# Altium project Adafruit RA8875 TFT Breakout.PrjPcb
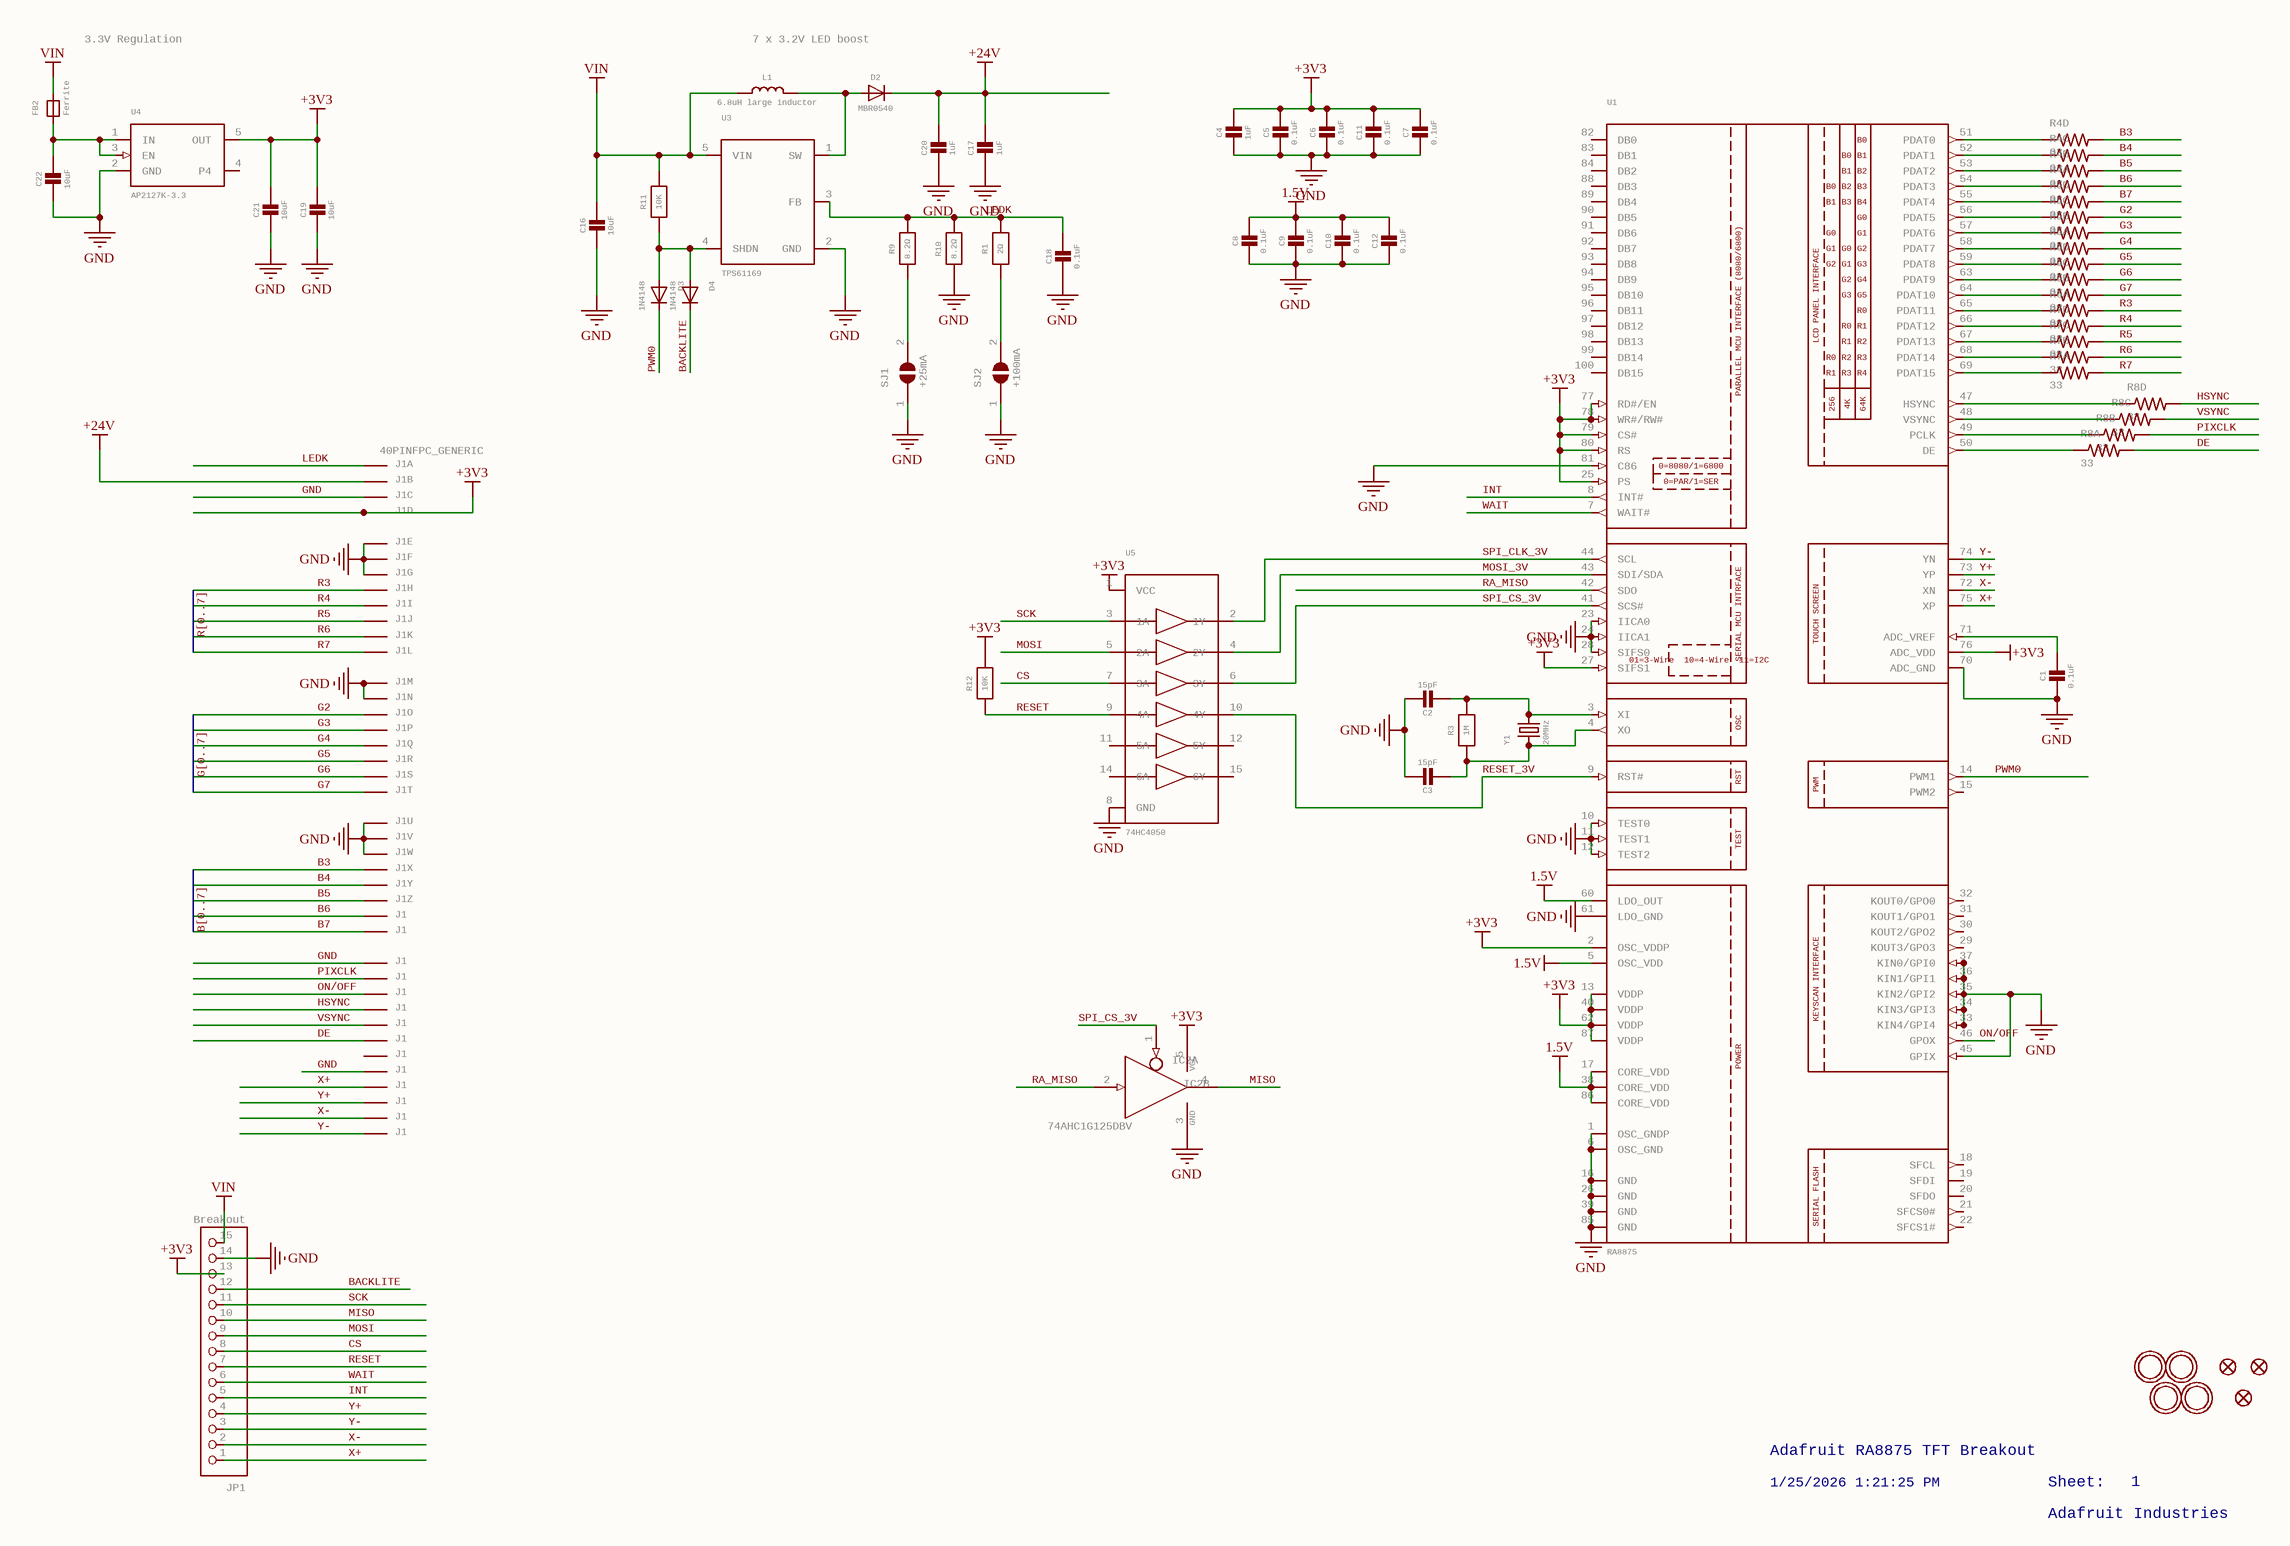
[diagram p0: Adafruit RA8875 TFT Breakout.SchDoc]
1 sheet, 52 parts. Net scope: global (net labels, ports and power ports of the same name join across sheets).

## Sheet Adafruit RA8875 TFT Breakout.SchDoc: Adafruit RA8875 TFT Breakout
size 409 x 289 mm; Origin: Eagle; Date: 1/25/2026 1:21:25 PM; SheetNumber: 1; GateName_1: G$1; SymbolName_1: FRAME_A3_ADAFRUIT; LibraryName: microbuilder; DeviceSetName: FRAME_A3_ADAFRUIT; Sheet: Sheet:; AdafruitIndustries: Adafruit Industries

### Parts
C1  0.1uF  [0603-NO]
C2  15pF  [0603-NO]
C3  15pF  [0603-NO]
C4  1uF  [0805-NO]
C5  0.1uF  [0603-NO]
C6  0.1uF  [0603-NO]
C7  0.1uF  [0603-NO]
C8  0.1uF  [0603-NO]
C9  0.1uF  [0603-NO]
C10  0.1uF  [0603-NO]
C11  0.1uF  [0603-NO]
C12  0.1uF  [0603-NO]
C16  10uF  [0805-NO]
C17  1uF  [0805-NO]
C18  0.1uF  [0603-NO]
C19  10uF  [0805-NO]
C20  1uF  [0805-NO]
C21  10uF  [0805-NO]
C22  10uF  [0805-NO]
D2  MBR0540  [SOD-123]
D3  1N4148  [SOD-323_MINI]
D4  1N4148  [SOD-323_MINI]
FB2  Ferrite  [0805-NO]
FID1  FIDUCIAL_1MM  [FIDUCIAL_1MM]  (value not drawn)
FID2  FIDUCIAL_1MM  [FIDUCIAL_1MM]  (value not drawn)
FID3  FIDUCIAL_1MM  [FIDUCIAL_1MM]  (value not drawn)
IC2  74AHC1G125DBV  [SOT23-5]  (parts A,B of 2)
J1  40PINFPC_GENERIC  [FPC_40]  (parts A,B,C,D,E,F,G,H,I,J,K,L,M,N,O,P,Q,R,S,T,U,V,W,X,Y,Z,27,28,29,30,31,32,33,34,35,36,37,38,39,40 of 40)
JP1  Breakout  [1X15-CB]
L1  6.8uH large inductor  [INDUCTOR_5X5MM_NR5040_NOTHERMALS]
R1  2Ω  [0805-NO]
R3  1M  [0603-NO]
R4  33  [RESPACK_4X0603]  (parts A,B,C,D of 4)
R5  33  [RESPACK_4X0603]  (parts A,B,C,D of 4)
R6  33  [RESPACK_4X0603]  (parts A,B,C,D of 4)
R7  33  [RESPACK_4X0603]  (parts A,B,C,D of 4)
R8  33  [RESPACK_4X0603]  (parts A,B,C,D of 4)
R9  8.2Ω  [0805-NO]
R10  8.2Ω  [0805-NO]
R11  10K  [0603-NO]
R12  10K  [0603-NO]
SJ1  +25mA  [SOLDERJUMPER_ARROW_NOPASTE]
SJ2  +100mA  [SOLDERJUMPER_ARROW_NOPASTE]
U1  RA8875  LCDPANELINTERFACE: LCD PANEL INTERFACE  TOUCHSCREEN: TOUCH SCREEN  KEYSCANINTERFACE: KEYSCAN INTERFACE  SERIALFLASH: SERIAL FLASH  SERIALMCUINTRFACE: SERIAL MCU INTRFACE  PARALLELMCUINTERFACE(8080/6800): PARALLEL MCU INTERFACE (8080/6800)  01=3-Wire
10=4-Wire
11=I2C: 01=3-Wire / 10=4-Wire / 11=I2C  [LQFP100]
U3  TPS61169  [SC70-5]
U4  AP2127K-3.3  [SOT23-5]
U5  74HC4050  [TSSOP16]
U$21  MOUNTINGHOLE2.5  [MOUNTINGHOLE_2.5_PLATED]  (value not drawn)
U$22  MOUNTINGHOLE2.5  [MOUNTINGHOLE_2.5_PLATED]  (value not drawn)
U$23  MOUNTINGHOLE2.5  [MOUNTINGHOLE_2.5_PLATED]  (value not drawn)
U$24  MOUNTINGHOLE2.5  [MOUNTINGHOLE_2.5_PLATED]  (value not drawn)
Y1  20MHz  [CRYSTAL_3.2X2.5]

### Nets
1.5V: C8.1 C9.1 C10.1 C12.1 U1.5(OSC_VDD) U1.17(CORE_VDD) U1.38(CORE_VDD) U1.60(LDO_OUT) U1.86(CORE_VDD)
+3V3: C4.1 C5.1 C6.1 C7.1 C11.1 C19.1 C21.1 IC2.5(VCC) J1.4(MS) JP1.13 R12.2 U1.2(OSC_VDDP) U1.13(VDDP) U1.25(PS) U1.27(SIFS1) U1.40(VDDP) U1.62(VDDP) U1.76(ADC_VDD) U1.77(RD#/EN) U1.78(WR#/RW#) U1.79(CS#) U1.80(RS) U1.87(VDDP) U4.5(OUT) U5.1(VCC)
+24V: C17.1 C20.1 D2.C J1.2(MS)
GND: C1.2 C2.1 C3.1 C4.2 C5.2 C6.2 C7.2 C8.2 C9.2 C10.2 C11.2 C12.2 C16.2 C17.2 C18.2 C19.2 C20.2 C21.2 C22.2 IC2.3(GND) J1.3(MS) J1.5(MS) J1.6(MS) J1.7(MS) J1.13(MS) J1.14(MS) J1.21(MS) J1.22(MS) J1.23(MS) J1.29(MS) J1.36(MS) JP1.14 R10.1 SJ1.1 SJ2.1 U1.1(OSC_GNDP) U1.6(OSC_GND) U1.10(TEST0) U1.11(TEST1) U1.12(TEST2) U1.16(GND) U1.23(IICA0) U1.24(IICA1) U1.26(GND) U1.28(SIFS0) U1.33(KIN4/GPI4) U1.34(KIN3/GPI3) U1.35(KIN2/GPI2) U1.36(KIN1/GPI1) U1.37(KIN0/GPI0) U1.39(GND) U1.45(GPIX) U1.61(LDO_GND) U1.70(ADC_GND) U1.81(C86) U1.85(GND) U3.2(GND) U4.2(GND) U5.8(GND)
VIN: C16.1 FB2.2(P$2) JP1.15 L1.P$1 R11.2 U3.5(VIN)
B3: J1.24(MS) R4.5
B4: J1.25(MS) R4.6  [also labelled B[0..7]]
B5: J1.26(MS) R4.7
B6: J1.27(MS) R4.8
B7: J1.28(MS) R5.5
BACKLITE: D4.C JP1.12
CS: JP1.8 U5.7(3A)
DE: J1.34(MS) R8.8
G2: J1.15(MS) R5.6
G3: J1.16(MS) R5.7  [also labelled G[0..7]]
G4: J1.17(MS) R5.8
G5: J1.18(MS) R6.5
G6: J1.19(MS) R6.6
G7: J1.20(MS) R6.7
HSYNC: J1.32(MS) R8.5
INT: JP1.5 U1.8(INT#)
LEDK: C18.1 J1.1(MSV) R1.2 R9.2 R10.2 U3.3(FB)
MISO: IC2.4(O) JP1.10
MOSI: JP1.9 U5.5(2A)
MOSI_3V: U1.43(SDI/SDA) U5.4(2Y)
ON/OFF: J1.31(MS) U1.46(GPOX)
PIXCLK: J1.30(MS) R8.7
PWM0: D3.C U1.14(PWM1)
R3: J1.8(MS) R6.8  [also labelled R[0..7]]
R4: J1.9(MS) R7.5
R5: J1.10(MS) R7.6
R6: J1.11(MS) R7.7
R7: J1.12(MS) R7.8
RA_MISO: IC2.2(I) U1.42(SDO)
RESET: JP1.7 R12.1 U5.9(4A)
RESET_3V: U1.9(RST#) U5.10(4Y)
SCK: JP1.11 U5.3(1A)
SPI_CLK_3V: U1.44(SCL) U5.2(1Y)
SPI_CS_3V: IC2.1(OE) U1.41(SCS#) U5.6(3Y)
VSYNC: J1.33(MS) R8.6
WAIT: JP1.6 U1.7(WAIT#)
X+: J1.37(MS) JP1.1 U1.75(XP)
X-: J1.39(MS) JP1.2 U1.72(XN)
Y+: J1.38(MS) JP1.4 U1.73(YP)
Y-: J1.40(MS) JP1.3 U1.74(YN)
NetC1_1: C1.1 U1.71(ADC_VREF)
NetC2_2: C2.2 R3.2 U1.3(XI) Y1.2
NetC3_2: C3.2 R3.1 U1.4(XO) Y1.1
NetC22_1: C22.1 FB2.1(P$1) U4.1(IN) U4.3(EN)
NetD2_A: D2.A L1.P$2 U3.1(SW)
NetD3_A: D3.A D4.A R11.1 U3.4(SHDN)
NetR1_1: R1.1 SJ2.2
NetR4_1: R4.1 U1.54(PDAT3)
NetR4_2: R4.2 U1.53(PDAT2)
NetR4_3: R4.3 U1.52(PDAT1)
NetR4_4: R4.4 U1.51(PDAT0)
NetR5_1: R5.1 U1.58(PDAT7)
NetR5_2: R5.2 U1.57(PDAT6)
NetR5_3: R5.3 U1.56(PDAT5)
NetR5_4: R5.4 U1.55(PDAT4)
NetR6_1: R6.1 U1.65(PDAT11)
NetR6_2: R6.2 U1.64(PDAT10)
NetR6_3: R6.3 U1.63(PDAT9)
NetR6_4: R6.4 U1.59(PDAT8)
NetR7_1: R7.1 U1.69(PDAT15)
NetR7_2: R7.2 U1.68(PDAT14)
NetR7_3: R7.3 U1.67(PDAT13)
NetR7_4: R7.4 U1.66(PDAT12)
NetR8_1: R8.1 U1.50(DE)
NetR8_2: R8.2 U1.49(PCLK)
NetR8_3: R8.3 U1.48(VSYNC)
NetR8_4: R8.4 U1.47(HSYNC)
NetR9_1: R9.1 SJ1.2

Not connected (* = marked no-connect by the designer): J1 35(MS); U1 15(PWM2) 18(SFCL) 19(SFDI) 20(SFDO) 21(SFCS0#) 22(SFCS1#) 29(KOUT3/GPO3) 30(KOUT2/GPO2) 31(KOUT1/GPO1) 32(KOUT0/GPO0) 82(DB0) 83(DB1) 84(DB2) 88(DB3) 89(DB4) 90(DB5) 91(DB6) 92(DB7) 93(DB8) 94(DB9) 95(DB10) 96(DB11) 97(DB12) 98(DB13) 99(DB14) 100(DB15); U4 4(P4); U5 11(5A) 12(5Y) 14(6A) 15(6Y)

### Notes on the sheet
- 3.3V Regulation
- 7 x 3.2V LED boost
- Adafruit RA8875 TFT Breakout
- 1/25/2026 1:21:25 PM
- Sheet:
- Adafruit Industries
- 1

### Library data of the parts
C1-C3 C5-C12 C18 = CAP_CERAMIC0603_NO: Ceramic Capacitors   For new designs, use the packages preceded by an '_' character since they are more reliable:   The following footprints should be used on most boards: _0402 - Standard footprint for regular board layouts  _0603 - Standard footprint for regular board layouts  _0805 - Standard footprint for regular board layouts  _1206 - Standard footprint for regular board layouts       For extremely tight-pitch boards where space is at a premium, the following 'micro-pitch' footprints can be used (smaller pads, no silkscreen outline, etc.): _0402MP - Micro-pitch footprint for very dense/compact boards  _0603MP - Micro-pitch footprint for very dense/compact boards  _0805MP - Micro-pitch footprint for very dense/compact boards  _1206MP - Micro-pitch footprint for very dense/compact boards; GateName_1: G$1; SymbolName_1: CAPACITOR; DeviceName: 0603_NO; LibraryName: microbuilder; DeviceSetName: CAP_CERAMIC
C4 C16 C17 C19-C22 = CAP_CERAMIC0805-NOOUTLINE: Ceramic Capacitors   For new designs, use the packages preceded by an '_' character since they are more reliable:   The following footprints should be used on most boards: _0402 - Standard footprint for regular board layouts  _0603 - Standard footprint for regular board layouts  _0805 - Standard footprint for regular board layouts  _1206 - Standard footprint for regular board layouts       For extremely tight-pitch boards where space is at a premium, the following 'micro-pitch' footprints can be used (smaller pads, no silkscreen outline, etc.): _0402MP - Micro-pitch footprint for very dense/compact boards  _0603MP - Micro-pitch footprint for very dense/compact boards  _0805MP - Micro-pitch footprint for very dense/compact boards  _1206MP - Micro-pitch footprint for very dense/compact boards; GateName_1: G$1; SymbolName_1: CAPACITOR; DeviceName: 0805-NOOUTLINE; LibraryName: microbuilder; DeviceSetName: CAP_CERAMIC
D2 = DIODESOD-123: Diode    SMA      Model	  Volts	  Amps	  Type	  Vf	  Ir	  Digikey #	  Notes	     SSA34-E3	  40V	  3A	  Schottky	  480mV @ 3A	  200uA @ 40V	  SSA34-E3/61TGITR-ND	  	     CDBA120-G	  20V	  1A	  Schottky	  500mV @ 1A	  500uA @ 20V	  641-1014-6-ND	  REEL	     MBRA210	  10V	  2A	  Schottky	  350mV @ 2A	  700uA @ 10V	  MBRA210LT3	  	 SOD-123      Model	  Volts	  Amps	  Type	  Vf	  Ir	  Order #	  Notes	     BAT54T1G	  30V	  200mA	  Schottky	  800mV @ 200mA	  2uA @ 25V	  BAT54T1GOSTR-ND	  	     B0530W	  30V	  500mA	  Schottky	  430mV @ 500mA	  130uA @ 30V	  B0530W-FDICT-ND	  REEL	     MBR120	  20V	  1A	  Schottky	  340mV @ 1A	  	  MBR120VLSFT1GOSCT-ND	  	 SOD-323      Model	  Volts	  Amps	  Type	  Vf	  Ir	  Order #	  Notes	     PMEG2005EJ	  20V	  500mA	  Schottky	  355mV @ 500mA	  	  568-4110-1-ND	  	     ZLLS410	  10V	  570mA	  Schottky	  380mV @ 570mA	  	  ZLLS410CT-ND	  	     1N4148WS	  75V	  150mA	  Silicon/Simple	  1V	  	  1N4148WSFSCT-ND	  REEL	 SOD-523      Model	  Volts	  Amps	  Type	  Vf	  Ir	  Order #	  Notes	     BAT54XV2	  30V	  200mA	  Schottky	  0.8V @ 100mA	  	  BAT54XV2CT-ND	  	     TB751S	  30V	  30mA	  Schottky	  	  	  RB751S-40TE61CT-ND	  	 SOT23-R/W (R = Solder Paste/Reflow Ovens, W = Hand-Soldering)       Model	  Volts	  Amps	  Type	  Vf	  Ir	  Order #	  Notes	     BAT54FILM	  40V	  300mA	  Schottky	  	  	  497-7162-1-ND	  	 POWERDI-5       Model	  Volts	  Amps	  Type	  Vf	  Ir	  Order #	  Notes	     PDS560	  60V	  5A	  Schottky	  670mV @ 5A	  150uA @ 60V	  PDS560DICT-ND; GateName_1: G$1; SymbolName_1: DIODE; DeviceName: SOD-123; LibraryName: microbuilder; DeviceSetName: DIODE
D3 D4 = DIODE_SOD323MINI: Diode    SMA      Model	  Volts	  Amps	  Type	  Vf	  Ir	  Digikey #	  Notes	     SSA34-E3	  40V	  3A	  Schottky	  480mV @ 3A	  200uA @ 40V	  SSA34-E3/61TGITR-ND	  	     CDBA120-G	  20V	  1A	  Schottky	  500mV @ 1A	  500uA @ 20V	  641-1014-6-ND	  REEL	     MBRA210	  10V	  2A	  Schottky	  350mV @ 2A	  700uA @ 10V	  MBRA210LT3	  	 SOD-123      Model	  Volts	  Amps	  Type	  Vf	  Ir	  Order #	  Notes	     BAT54T1G	  30V	  200mA	  Schottky	  800mV @ 200mA	  2uA @ 25V	  BAT54T1GOSTR-ND	  	     B0530W	  30V	  500mA	  Schottky	  430mV @ 500mA	  130uA @ 30V	  B0530W-FDICT-ND	  REEL	     MBR120	  20V	  1A	  Schottky	  340mV @ 1A	  	  MBR120VLSFT1GOSCT-ND	  	 SOD-323      Model	  Volts	  Amps	  Type	  Vf	  Ir	  Order #	  Notes	     PMEG2005EJ	  20V	  500mA	  Schottky	  355mV @ 500mA	  	  568-4110-1-ND	  	     ZLLS410	  10V	  570mA	  Schottky	  380mV @ 570mA	  	  ZLLS410CT-ND	  	     1N4148WS	  75V	  150mA	  Silicon/Simple	  1V	  	  1N4148WSFSCT-ND	  REEL	 SOD-523      Model	  Volts	  Amps	  Type	  Vf	  Ir	  Order #	  Notes	     BAT54XV2	  30V	  200mA	  Schottky	  0.8V @ 100mA	  	  BAT54XV2CT-ND	  	     TB751S	  30V	  30mA	  Schottky	  	  	  RB751S-40TE61CT-ND	  	 SOT23-R/W (R = Solder Paste/Reflow Ovens, W = Hand-Soldering)       Model	  Volts	  Amps	  Type	  Vf	  Ir	  Order #	  Notes	     BAT54FILM	  40V	  300mA	  Schottky	  	  	  497-7162-1-ND	  	 POWERDI-5       Model	  Volts	  Amps	  Type	  Vf	  Ir	  Order #	  Notes	     PDS560	  60V	  5A	  Schottky	  670mV @ 5A	  150uA @ 60V	  PDS560DICT-ND; GateName_1: G$1; SymbolName_1: DIODE; DeviceName: _SOD323MINI; LibraryName: microbuilder; DeviceSetName: DIODE
FB2 = FERRITE-0805NO: Ferrite Bead   0603 MMZ1608B121C - 120 Ohm @ 100MHz, 600mA, 0.15 Ohm DC Resistance - Digikey: 445-2164-1-ND  BK1608HW121-T - 120 Ohm, 600mA Ferrite Chip - Digikey: 587-1876-2-ND       0805 HZ0805B272R-10 - 2.7K Ohm @ 100MHz, 200mA, 0.8 Ohm DC Resistance - Digikey: 240-2504-1-ND (see also Murata BLM21BD272SN1L)  MMZ2012Y152B - 1.5K Ohm @ 100MHz, 500mA, 0.4 Ohm DC Resistance - Digikey: 445-1560-1-ND - Mainly for high frequency (80-400MHz)  MMZ2012R102A - 1K Ohm @ 100MHz, 500mA, 0.3 Ohm DC Resistance - Digikey: 445-1555-2-ND - More general purpose (10-200MHz); GateName_1: G$1; SymbolName_1: FERRITE; DeviceName: -0805NO; LibraryName: microbuilder; DeviceSetName: FERRITE
FID1-FID3 = FIDUCIAL_1MM: Fiducial Alignment Points   Various fiducial points for machine vision alignment.; GateName_1: G$1; DeviceName: _1MM; BOM: EXCLUDE; SymbolName_1: FIDUCIAL; LibraryName: microbuilder; DeviceSetName: FIDUCIAL
IC2 = 74*1G125DBV: Single Bus Buffer Gate with 3-State Output; GateName_1: A; SymbolName_1: 74125; GateName_2: P; SymbolName_2: PWRN; DeviceName: DBV; POPULARITY: 0; LibraryName: 74xx-little-us; DeviceSetName: 74*1G125
J1 = 40PINFPC_GENERIC: OMRON FPC Connector   Source : http://www.omron.com/ecb/products/pdf/fpc.pdf    XF2M-4015-rev is good for connecting up 'PSP' SHARP LQ043 LCDs; GateName_1: -1; SymbolName_1: PV; GateName_2: -2; SymbolName_2: P; GateName_3: -3; GateName_4: -4; GateName_5: -5; GateName_6: -6; GateName_7: -7; GateName_8: -8; GateName_9: -9; GateName_10: -10; GateName_11: -11; GateName_12: -12; GateName_13: -13; GateName_14: -14; GateName_15: -15; GateName_16: -16; GateName_17: -17; GateName_18: -18; GateName_19: -19; GateName_20: -20; GateName_21: -21; GateName_22: -22; GateName_23: -23; GateName_24: -24; GateName_25: -25; GateName_26: -26; GateName_27: -27; GateName_28: -28; GateName_29: -29; GateName_30: -30; GateName_31: -31; GateName_32: -32; GateName_33: -33; GateName_34: -34; GateName_35: -35; GateName_36: -36; GateName_37: -37; GateName_38: -38; GateName_39: -39; GateName_40: -40; SymbolName_3: P; SymbolName_4: P; SymbolName_5: P; SymbolName_6: P; SymbolName_7: P; SymbolName_8: P; SymbolName_9: P; SymbolName_10: P; SymbolName_11: P; SymbolName_12: P; SymbolName_13: P; SymbolName_14: P; SymbolName_15: P; SymbolName_16: P; SymbolName_17: P; SymbolName_18: P; SymbolName_19: P; SymbolName_20: P; SymbolName_21: P; SymbolName_22: P; SymbolName_23: P; SymbolName_24: P; SymbolName_25: P; SymbolName_26: P; SymbolName_27: P; SymbolName_28: P; SymbolName_29: P; SymbolName_30: P; SymbolName_31: P; SymbolName_32: P; SymbolName_33: P; SymbolName_34: P; SymbolName_35: P; SymbolName_36: P; SymbolName_37: P; SymbolName_38: P; SymbolName_39: P; SymbolName_40: P; DeviceName: _GENERIC; LibraryName: adafruit_display; DeviceSetName: 40PINFPC
JP1 = PINHD-1X15-CB: PIN HEADER; GateName_1: A; SymbolName_1: PINHD15; DeviceName: -CB; LibraryName: adafruit; DeviceSetName: PINHD-1X15
L1 = INDUCTORNR5040: Inductors   0603: 10nH Ceramic Inductor - microwire antenna/RF (Digikey: 712-1434-2-ND)       0805: 560nH Ceramic Inductor - RF (Digikey: 553-1047-1-ND)  270nH Ceramic Inductor - Q = 40@250MHz, +-5%, 1 Ohm DC Resistance (Digikey: 535-10506-2-ND)       1007 (2518 Metric) SMT: 10ÂµH 10% 250mOhm 820mA 1007 Inductor (Digikey: 587-2189-1-ND)  22ÂµH 10% 500mOhm 580mA 1007 Inductor (Digikey: 587-2190-1-ND)  47ÂµH 10% 950mOhm 420mA 1007 Inductor (Digikey: 587-2191-1-ND)  47ÂµH 5% 100mOhm 1A 1008 Inductor (Digikey: 732-1816-1-ND)       5.0x5.0mm (Taiyo Yuden NR5040 Series) 6.8ÂµH 20% 2.3A 64mOhm Inductor (Digikey: 587-2374-2-ND)       5.0x5.0mm (TDK VLC5045 Series) 4.7ÂµH 20% 3.3A 34mOhm Inductor (Digikey: 445-6526-1-ND)  6.8ÂµH 20% 2.7A 46mOhm Inductor (Digikey: 445-6527-1-ND)       6.0x6.0mm (TDK VLC6045 Series) 4.7ÂµH 20% 3.8A 27mOhm Inductor (Digikey: 445-6538-2-ND)  6.8ÂµH 20% 3A 41mOhm Inductor (Digikey: 445-6540-1-ND)  6.2ÂµH 30% 2.2A 45mOhm Inductor (Digikey: SRR5028-6R2YCT-ND) - Not TDK VLC6045 but footprint should match       6.0x6.0mm (TDK SLF6045 Series) 6.8uH 30% 2A 33mOhm Inductor (Digikey: 445-4572-1-ND, Mouser: 810-SLF645T6R8N2R0PF)       6.0x6.0mm (Sumida CDRH5D28 Series) 6.2uH 30% 1.8A 45mOhm Inductor (Digikey: 308-1542-1-ND)       Taiyo Yuden NR3015T2R2M - 2.2uH 20% 1.5A (Digikey: 587-1648-2-ND, Mouser: 963-NR3015T2R2M) - Used with TI TPS62172   CoilCraft RFID Transponder Coil - MA5532-AE (For use with AS3935 Lightning Sensor)   Taiyo Yuden NRH2412T2R2MNGH - 2.2uH 20% 1AA (Digikey: 587-3443-1-ND) - Used with TI LM3671   Vishay IHLP  1.0uH Molded Inductor - 24mOhm DCR, 5A, +/-20%, -55Â°C-125Â°C (Digikey: 541-1319-1-ND); GateName_1: G$1; SymbolName_1: INDUCTOR; DeviceName: NR5040; LibraryName: microbuilder; DeviceSetName: INDUCTOR
R1 R9 R10 = RESISTOR0805_NOOUTLINE: Resistors   For new designs, use the packages preceded by an '_' character since they are more reliable:   The following footprints should be used on most boards: _0402 - Standard footprint for regular board layouts  _0603 - Standard footprint for regular board layouts  _0805 - Standard footprint for regular board layouts  _1206 - Standard footprint for regular board layouts       For extremely tight-pitch boards where space is at a premium, the following 'micro-pitch' footprints can be used (smaller pads, no silkscreen outline, etc.): _0402MP - Micro-pitch footprint for very dense/compact boards  _0603MP - Micro-pitch footprint for very dense/compact boards  _0805MP - Micro-pitch footprint for very dense/compact boards  _1206MP - Micro-pitch footprint for very dense/compact boards; GateName_1: G$1; SymbolName_1: RESISTOR; DeviceName: 0805_NOOUTLINE; LibraryName: microbuilder; DeviceSetName: RESISTOR
R3 R11 R12 = RESISTOR_0603_NOOUT: Resistors   For new designs, use the packages preceded by an '_' character since they are more reliable:   The following footprints should be used on most boards: _0402 - Standard footprint for regular board layouts  _0603 - Standard footprint for regular board layouts  _0805 - Standard footprint for regular board layouts  _1206 - Standard footprint for regular board layouts       For extremely tight-pitch boards where space is at a premium, the following 'micro-pitch' footprints can be used (smaller pads, no silkscreen outline, etc.): _0402MP - Micro-pitch footprint for very dense/compact boards  _0603MP - Micro-pitch footprint for very dense/compact boards  _0805MP - Micro-pitch footprint for very dense/compact boards  _1206MP - Micro-pitch footprint for very dense/compact boards; GateName_1: G$1; SymbolName_1: RESISTOR; DeviceName: _0603_NOOUT; LibraryName: microbuilder; DeviceSetName: RESISTOR
R4-R8 = RESISTOR_4PACK_US: Resistor Packs (4 resistors)   4 x 0603 10K 1/16W - Digikey: YC164J-10KCT-ND; GateName_1: G$1; SymbolName_1: R-US; GateName_2: G$2; GateName_3: G$3; GateName_4: G$4; SymbolName_2: R-US; SymbolName_3: R-US; SymbolName_4: R-US; LibraryName: microbuilder; DeviceSetName: RESISTOR_4PACK_US
SJ1 SJ2 = SOLDERJUMPER: SMD Solder JUMPER   Solder the two pads together to create a connection, or remove the solder to break it.REFLOW - Use this footprint for solder paste and reflow ovens. WAVE - Use this footprint for hand-soldering (larger pads).    CLOSED - Has a trace between the two pads to ensure it is closed by default.  The trace needs to be cut to disable the jumper, and can be closed again by creating a solder bridge between the two pads.; GateName_1: 1; BOM: EXCLUDE; SymbolName_1: SOLDERJUMPER; LibraryName: microbuilder; DeviceSetName: SOLDERJUMPER
U1 = RA8875: RA8875 TFT LCD Controller; GateName_1: G$1; SymbolName_1: RA8875; LibraryName: microbuilder; DeviceSetName: RA8875; 256: 256; 4K: 4K; 64K: 64K; R0: R0; R1: R1; G0: G0; G1: G1; G2: G2; B0: B0; B1: B1; R2: R2; R3: R3; G3: G3; B2: B2; B3: B3; R4: R4; G4: G4; G5: G5; B4: B4; 0=8080/1=6800: 0=8080/1=6800; 0=PAR/1=SER: 0=PAR/1=SER; PWM: PWM; OSC: OSC; RST: RST; POWER: POWER; TEST: TEST
U3 = VREG_BOOST_5PIN_SC70: FAN5331 - LED/OLED 20V Boost Converter   Digikey: FAN5331SXCT-ND; GateName_1: G$1; SymbolName_1: GENERIC_DCDC_5PIN; DeviceName: _SC70; LibraryName: adafruit_power; DeviceSetName: VREG_BOOST_5PIN
U4 = VREG_SOT23-5: SOT23-5 Fixed Voltage Regulators      Part	Current Out	V Out	V In	V Dropout	Î¸JA (Â°C/W)	TJ (Â°C)	Digikey Part No.	     ADP121	  150mA	  3.3V	  3.4-5.5V	  0.09V @ 150mA	  --	  --	  ADP121-AUJZ33R7CT-ND	     ADP121	  150mA	  3.0V	  3.1-5.5V	  0.09V @ 150mA	  --	  --	  ADP121-AUJZ30R7CT-ND	     ADP122	  300mA	  3.3V	  3.4-5.5V	  0.085V @ 300mA	  --	  --	  ADP122AUJZ-3.3-R7CT-ND	     ADP1712	  300mA	  3.3V	  3.5-5.5V	  0.17V @ 300mA	  --	  --	  ADP1712AUJZ-3.3-R7TR-ND	     AP7311 (Low Cost)	  150mA	  3.3V	  3.5-6V	  0.15V @ 150mA	  --	  --	  AP7311-33WG-7DICT-ND	     LD39015M18R	  150mA	  1.8V	  1.9V-5.5V	  0.08V @ 100mA	  --	  --	  497-6977-1-ND	     LP2985A-33DBVR	  150mA	  3.3V	  3.3-16V	  0.28V @ 150mA	  206	  150	  296-18479-1-ND	     MCP1824T-3302E/OT	  300mA	  3.3V	  3.5V-6V	  0.2V @ 300mA	  --	  --	  MCP1824T-3302E/OTCT-ND	     MIC5205-2.5YM5 TR	  150mA	  2.5V	  2.7-16V	  0.165V @ 150mA	  --	  --	  576-1257-2-ND	     MIC5205-3.0YM5 TR	  150mA	  3.0V	  3.2V-16V	  0.165V @ 150mA	  --	  --	  576-1258-2-ND	     MIC5205-3.3YM5 TR	  150mA	  3.3V	  3.5V-16V	  0.165V @ 150mA	  --	  --	  576-1259-2-ND	     TPS780330220	  150mA	  3.3V+2.2V	  3.6-5.5V	  250mV Max	  --	  --	  296-23332-1-ND	     TDA3663/N1,135	  100mA	  3.3V	  3.5-45V	  0.18V @ 50mA	  --	  --	  568-5343-1-ND	     	  	  	  	  	  	  	  	     	  	  	  	  	  	  	  	   Max operating temp can be calculated using Î¸JA, TJ (max junction temperature), and power in watts.  Set the "Maximum Ambient Temperature" until it reaches TJ ("Max Junction Temperature"), which is the absolute limit for safe use of the regulator: Heat Sink Temperature Calculator   For example, With 12V source into a 3.3V LP2985 and a 30mA load, we are dissipating (12V-3.3V) * 0.03A = 0.261W.  With a Î¸JA of 206 Â°C/W, a TJ of 150Â°C, and 261mW we can safely use the chip without a heat sink up to 75Â°C (=147.1Â°C Junction Temperature).; GateName_1: G$1; SymbolName_1: VREG_SOT23-5; LibraryName: adafruit_power; DeviceSetName: VREG_SOT23-5; JLC_ROTATION: 270
U5 = 74HC4050DTSSOP: 6-channel level shifter    74HC4050D - 2V-6V Supply   SOIC16 Digikey: 74HC4050D,653-ND  Mouser: 771-74HC4050D-T        TSSOP16 Digikey: 296-9215-1-ND  Mouser:; GateName_1: G$1; DeviceName: TSSOP; SymbolName_1: 74HC4050D; LibraryName: microbuilder; DeviceSetName: 74HC4050D
U$21-U$24 = MOUNTINGHOLE2.5: Mounting Hole   For #2 screws (0.086"/2.18mm width, 0.094"/2.4mm hole) use 2.5mm; GateName_1: G$1; DeviceName: 2.5; BOM: EXCLUDE; SymbolName_1: MOUNTINGHOLE; LibraryName: adafruit_electromech; DeviceSetName: MOUNTINGHOLE
Y1 = CRYSTAL3.2X2.5: Crystals   HC49UP - Surface Mount Crystal  4.0MHz 18pF +/-30ppm Surface Mount Crystal [Digikey: 535-9857-1-ND]  12.0 MHz Surface Mount Crystal [Digikey: 535-9869-6-ND]  25.0 MHz Surface Mount Crystal [Digikey: 535-9078-1-ND]       2.5 x 2.0mm - MEMs SMT Crystal  16.0 MHz 10pF 20ppm 2.5 x 2.0mm Crystal [Digikey -40-85Â°C: 535-10923-1-ND]       3.2 x 2.5mm - MEMs SMT Crystal  12.0 MHz 8pF 15ppm 3.2 x 2.5mm Crystal [Digikey: -10-70Â°C: 644-1047-1-ND -40-125Â°C: 644-1128-1-ND] 40~85Â°C cheaper: 644-1173-6-ND  16.0 MHz 8pF 15ppm 3.2 x 2.5mm Crystal [Digikey: -10-70Â°C: 644-1049-1-ND -40-125Â°C: 644-1129-2-ND]-40~85Â°C cheaper: 644-1175-6-ND  16.0 MHz 10pF 10ppm 3.2 x 2.5mm Crystal [Digikey: 644-1100-1-ND]  27.12 MHz 18pF 30ppm 3.2 x 2.5mm Crystal [Digikey: 887-1424-1-ND]  27.12MHz 10pF 10ppm 3.2 x 2.5mm Crystal [Digikey: 887-1329-1-ND]       4.9 x 1.8mm - MEMs SMT Crystal  32.768 KHz 12.5pF 20ppm 4.9 x 1.8mm Crystal [Digikey: SE2415CT-ND]       8.0 x 3.8mm - Surface Mount Crystal  32.768kHz 12.5pF 20ppm -40Â°C-85Â°C [Digikey: 535-9166-2-ND]       Cylinder 32.768KHz Cylinder Crystal (2x6mm body) [Ex. Digikey: 300-8341-2-ND]; GateName_1: G$1; SymbolName_1: CRYSTAL; DeviceName: 3.2X2.5; LibraryName: microbuilder; DeviceSetName: CRYSTAL